# Altium project RadioTransceiverBoard.PrjPcb (part 3 of 3)

## Sheet A_conn_1P25A.SchDoc
size A; SheetNumber: 8; SheetTotal: 17
Used 11 times, as channels LMS Powering/A_conn_1P25A1, LMS Powering/A_conn_1P25A2, LMS Powering/A_conn_1P25A3, LMS Powering/A_conn_1P25A4, LMS Powering/A_conn_1P25A5, LMS Powering/A_conn_1P25A6, LMS Powering/A_conn_1P25A7, LMS Powering/A_conn_1P25A8, LMS Powering/A_conn_1P25A9, LMS Powering/A_conn_1P25A10, LMS Powering/A_conn_1P25A11. Parts and nets are listed once, with the designators drawn on the sheet.
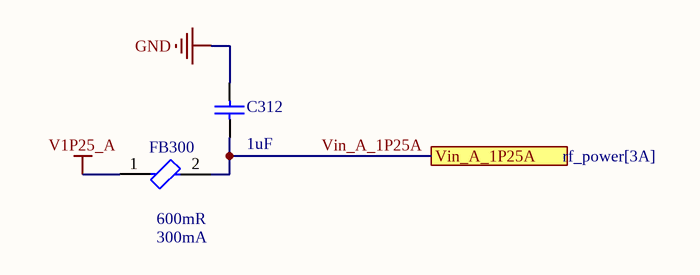
[diagram p8: A_conn_1P25A.SchDoc]

### Parts
C312  value 1uF  [CAPC2013X145X50LL20T25]  (hidden comment: C0805C105K4PACTU)
FB300  DC Resistance-Max: 600mR  Max DC Current: 300mA  [FP-BLM15-0_05-MFG]  (hidden comment: BLM15AG601SN1D)

### Ports
Vin_A_1P25A (see rf_power[3A])

### Nets
GND: C312.2
V1P25_A: FB300.1
Vin_A_1P25A: C312.1 FB300.2 ; port Vin_A_1P25A

### Channels
LMS Powering/A_conn_1P25A1: designators end in _1; ports Vin_A_1P25A=Vin_A_1P25A
LMS Powering/A_conn_1P25A2: designators end in _2; ports Vin_A_1P25A=Vin_A_1P25A
LMS Powering/A_conn_1P25A3: designators end in _3; ports Vin_A_1P25A=Vin_A_1P25A
LMS Powering/A_conn_1P25A4: designators end in _4; ports Vin_A_1P25A=Vin_A_1P25A
LMS Powering/A_conn_1P25A5: designators end in _5; ports Vin_A_1P25A=Vin_A_1P25A
LMS Powering/A_conn_1P25A6: designators end in _6; ports Vin_A_1P25A=Vin_A_1P25A
LMS Powering/A_conn_1P25A7: designators end in _7; ports Vin_A_1P25A=Vin_A_1P25A
LMS Powering/A_conn_1P25A8: designators end in _8; ports Vin_A_1P25A=Vin_A_1P25A
LMS Powering/A_conn_1P25A9: designators end in _9; ports Vin_A_1P25A=Vin_A_1P25A
LMS Powering/A_conn_1P25A10: designators end in _10; ports Vin_A_1P25A=Vin_A_1P25A
LMS Powering/A_conn_1P25A11: designators end in _11; ports Vin_A_1P25A=Vin_A_1P25A

### Library data of the parts
C312 = CMP-1036-04746-2: Manufacturer: Kemet; Part Number: C0805C105K4PACTU
FB300 = CMP-0686-00187-4: Chip Ferrite Bead, 0402, 600Ω @ 100MHz, 0.52Ω, 25%, 300mA; Number of Lines: 1; DC Resistance (DCR): 520mR; Shielding: Unshielded; Impedance: 600R; Material: Steel; Frequency: 100MHz; Lead Free: Lead Free; Test Frequency: 100MHz; Depth: 0.55mm; Length: 1mm; Case Code (Imperial): 0402; Packaging: Tape and Reel; Height: 0.5mm; Max Operating Temperature: 125°C; Military Standard: Not; REACH SVHC: No SVHC; Case Code (Metric): 1005; Series: BLM15AG_SN; Core Material: Ferrite; Termination: SMD/SMT; DC Current: 300mA; Package Quantity: 10000; Width: 0.5mm; RoHS Compliant: Yes; Min Operating Temperature: -55°C; Current Rating: 300mA; Case/Package: 0402; Number of Pins: 2; Radiation Hardening: No; Tolerance: 25%; Number of Circuits: 1; Max Current Rating: 300mA

## Sheet A_conn_1P4A.SchDoc
size A; SheetNumber: 5; SheetTotal: 17
Used 6 times, as channels LMS Powering/A_conn_1P4A1, LMS Powering/A_conn_1P4A2, LMS Powering/A_conn_1P4A3, LMS Powering/A_conn_1P4A4, LMS Powering/A_conn_1P4A5, LMS Powering/A_conn_1P4A6. Parts and nets are listed once, with the designators drawn on the sheet.
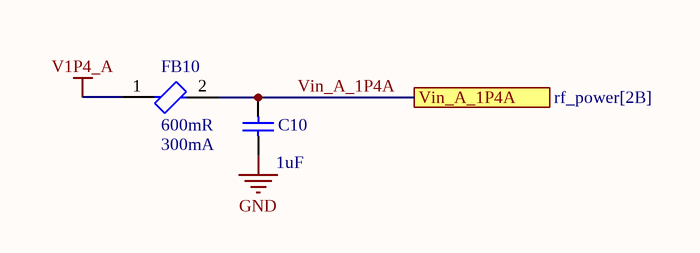
[diagram p9: A_conn_1P4A.SchDoc]

### Parts
C10  value 1uF  [CAPC2013X145X50LL20T25]  (hidden comment: C0805C105K4PACTU)
FB10  DC Resistance-Max: 600mR  Max DC Current: 300mA  [FP-BLM15-0_05-MFG]  (hidden comment: BLM15AG601SN1D)

### Ports
Vin_A_1P4A (see rf_power[2B])

### Nets
GND: C10.1
V1P4_A: FB10.1
Vin_A_1P4A: C10.2 FB10.2 ; port Vin_A_1P4A

### Channels
LMS Powering/A_conn_1P4A1: designators end in _1; ports Vin_A_1P4A=Vin_A_1P4A
LMS Powering/A_conn_1P4A2: designators end in _2; ports Vin_A_1P4A=Vin_A_1P4A
LMS Powering/A_conn_1P4A3: designators end in _3; ports Vin_A_1P4A=Vin_A_1P4A
LMS Powering/A_conn_1P4A4: designators end in _4; ports Vin_A_1P4A=Vin_A_1P4A
LMS Powering/A_conn_1P4A5: designators end in _5; ports Vin_A_1P4A=Vin_A_1P4A
LMS Powering/A_conn_1P4A6: designators end in _6; ports Vin_A_1P4A=Vin_A_1P4A

### Library data of the parts
C10 = CMP-1036-04746-2: Manufacturer: Kemet; Part Number: C0805C105K4PACTU
FB10 = CMP-0686-00187-4: as FB300 on sheet A_conn_1P25A; Frequency: 100MHz; Lead Free: Lead Free; Test Frequency: 100MHz; Depth: 0.55mm; Length: 1mm; Case Code (Imperial): 0402; Packaging: Tape and Reel; Height: 0.5mm; Max Operating Temperature: 125°C; Military Standard: Not; REACH SVHC: No SVHC; Case Code (Metric): 1005; Series: BLM15AG_SN; Core Material: Ferrite; Termination: SMD/SMT; DC Current: 300mA; Package Quantity: 10000; Width: 0.5mm; RoHS Compliant: Yes; Min Operating Temperature: -55°C; Current Rating: 300mA; Case/Package: 0402; Number of Pins: 2; Radiation Hardening: No; Tolerance: 25%; Number of Circuits: 1; Max Current Rating: 300mA

## Sheet B_conn_1P25A.SchDoc
size A; SheetNumber: 3; SheetTotal: 17
Used 3 times, as channels LMS Powering/B_conn_1P25A1, LMS Powering/B_conn_1P25A2, LMS Powering/B_conn_1P25A3. Parts and nets are listed once, with the designators drawn on the sheet.
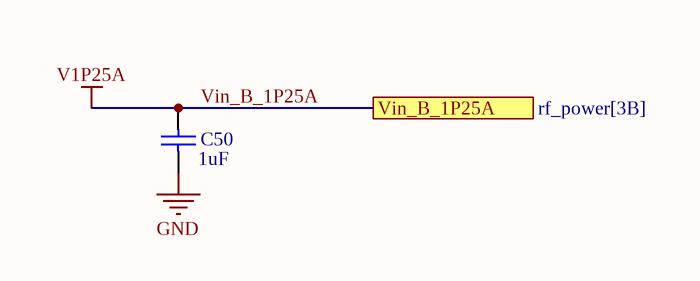
[diagram p10: B_conn_1P25A.SchDoc]

### Parts
C50  value 1uF  [CAPC2013X145X50LL20T25]  (hidden comment: C0805C105K4PACTU)

### Ports
Vin_B_1P25A (see rf_power[3B])

### Nets
GND: C50.1
Vin_B_1P25A: C50.2 ; port Vin_B_1P25A  [also labelled V1P25A]

### Channels
LMS Powering/B_conn_1P25A1: designators end in _1; ports Vin_B_1P25A=Vin_B_1P25A
LMS Powering/B_conn_1P25A2: designators end in _2; ports Vin_B_1P25A=Vin_B_1P25A
LMS Powering/B_conn_1P25A3: designators end in _3; ports Vin_B_1P25A=Vin_B_1P25A

### Library data of the parts
C50 = CMP-1036-04746-2: Manufacturer: Kemet; Part Number: C0805C105K4PACTU

## Sheet A_conn_1P25D.SchDoc
size A; SheetNumber: 9; SheetTotal: 17
Used 4 times, as channels LMS Powering/A_conn_1P25D1, LMS Powering/A_conn_1P25D2, LMS Powering/A_conn_1P25D3, LMS Powering/A_conn_1P25D4. Parts and nets are listed once, with the designators drawn on the sheet.
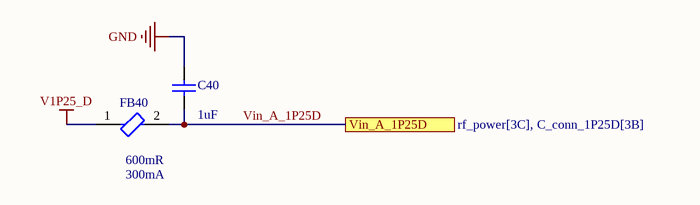
[diagram p11: A_conn_1P25D.SchDoc]

### Parts
C40  value 1uF  [CAPC2013X145X50LL20T25]  (hidden comment: C0805C105K4PACTU)
FB40  DC Resistance-Max: 600mR  Max DC Current: 300mA  [FP-BLM15-0_05-MFG]  (hidden comment: BLM15AG601SN1D)

### Ports
Vin_A_1P25D (see rf_power[3C], C_conn_1P25D[3B])

### Nets
GND: C40.2
V1P25_D: FB40.1
Vin_A_1P25D: C40.1 FB40.2 ; port Vin_A_1P25D

### Channels
LMS Powering/A_conn_1P25D1: designators end in _1; ports Vin_A_1P25D=Vin_A_1P25D
LMS Powering/A_conn_1P25D2: designators end in _2; ports Vin_A_1P25D=Vin_A_1P25D
LMS Powering/A_conn_1P25D3: designators end in _3; ports Vin_A_1P25D=Vin_A_1P25D
LMS Powering/A_conn_1P25D4: designators end in _4; ports Vin_A_1P25D=Vin_A_1P25D

### Library data of the parts
C40 = CMP-1036-04746-2: Manufacturer: Kemet; Part Number: C0805C105K4PACTU
FB40 = CMP-0686-00187-4: as FB300 on sheet A_conn_1P25A; Frequency: 100MHz; Lead Free: Lead Free; Test Frequency: 100MHz; Depth: 0.55mm; Length: 1mm; Case Code (Imperial): 0402; Packaging: Tape and Reel; Height: 0.5mm; Max Operating Temperature: 125°C; Military Standard: Not; REACH SVHC: No SVHC; Case Code (Metric): 1005; Series: BLM15AG_SN; Core Material: Ferrite; Termination: SMD/SMT; DC Current: 300mA; Package Quantity: 10000; Width: 0.5mm; RoHS Compliant: Yes; Min Operating Temperature: -55°C; Current Rating: 300mA; Case/Package: 0402; Number of Pins: 2; Radiation Hardening: No; Tolerance: 25%; Number of Circuits: 1; Max Current Rating: 300mA

## Sheet D_conn_1P25A.SchDoc
size A; SheetNumber: 6; SheetTotal: 17
Used 2 times, as channels LMS Powering/D_conn_1P25A1, LMS Powering/D_conn_1P25A2. Parts and nets are listed once, with the designators drawn on the sheet.
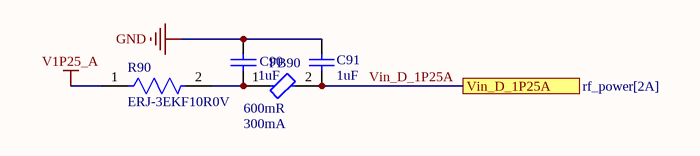
[diagram p12: D_conn_1P25A.SchDoc]

### Parts
C90  value 1uF  [CAPC2013X145X50LL20T25]  (hidden comment: C0805C105K4PACTU)
C91  value 1uF  [CAPC2013X145X50LL20T25]  (hidden comment: C0805C105K4PACTU)
FB90  DC Resistance-Max: 600mR  Max DC Current: 300mA  [FP-BLM15-0_05-MFG]  (hidden comment: BLM15AG601SN1D)
R90  ERJ-3EKF10R0V  [FP-ERJ3EK-MFG]

### Ports
Vin_D_1P25A (see rf_power[2A])

### Nets
GND: C90.2 C91.2
V1P25_A: R90.1
Vin_D_1P25A: C91.1 FB90.2 ; port Vin_D_1P25A
NetC90_1: C90.1 FB90.1 R90.2

### Channels
LMS Powering/D_conn_1P25A1: designators end in _1; ports Vin_D_1P25A=Vin_D_1P25A
LMS Powering/D_conn_1P25A2: designators end in _2; ports Vin_D_1P25A=Vin_D_1P25A

### Library data of the parts
C90 C91 = CMP-1036-04746-2: Manufacturer: Kemet; Part Number: C0805C105K4PACTU
FB90 = CMP-0686-00187-4: as FB300 on sheet A_conn_1P25A; Frequency: 100MHz; Lead Free: Lead Free; Test Frequency: 100MHz; Depth: 0.55mm; Length: 1mm; Case Code (Imperial): 0402; Packaging: Tape and Reel; Height: 0.5mm; Max Operating Temperature: 125°C; Military Standard: Not; REACH SVHC: No SVHC; Case Code (Metric): 1005; Series: BLM15AG_SN; Core Material: Ferrite; Termination: SMD/SMT; DC Current: 300mA; Package Quantity: 10000; Width: 0.5mm; RoHS Compliant: Yes; Min Operating Temperature: -55°C; Current Rating: 300mA; Case/Package: 0402; Number of Pins: 2; Radiation Hardening: No; Tolerance: 25%; Number of Circuits: 1; Max Current Rating: 300mA
R90 = CMP-2000-00195-2: RES SMD 10 OHM 1% 1/10W 0603; Manufacturer: Panasonic; Resistance: 10Ω; Voltage Rating: 75V; Value: 10Ω; Power: 100mW; Power Rating: 0.1W; Temperature Coefficient: 100ppm/°C; Automotive Grade: Grade 0; Lead Free: Yes; Device Class L1: Passive Components; Digikey Description: RES SMD 10 OHM 1% 1/10W 0603; Octopart: https://octopart.com/erj-3ekf10r0v-panasonic-55403649; Automotive: Yes; ComponentLink2URL: https://b2b-api.panasonic.eu/file_stream/pids/fileversion/1263; Manufacturer Part Number: ERJ-3EKF10R0V; Height: 0.55mm; Temperature Range High: +155°C; Footprint Url: https://industrial.panasonic.com/cdbs/www-data/pdf/RDA0000/DMA0000COL17.pdf; Temperature: -55°C to +155°C; Tolerance: 1%; ComponentLink2Description: Datasheet; Package: ERJ3EK; Device Class L2: Resistors; Category: Res; Ipc Land Pattern Name: RESC16080X45; RoHS: TRUE; Composition: Thick Film; Device Class L3: Chip SMD Resistors; Temperature Range Low: -55°C; Series: ERJ

## Sheet A_conn_1P8A.SchDoc
size A; SheetNumber: 7; SheetTotal: 17
Used 10 times, as channels LMS Powering/A_conn_1P8A1, LMS Powering/A_conn_1P8A2, LMS Powering/A_conn_1P8A3, LMS Powering/A_conn_1P8A4, LMS Powering/A_conn_1P8A5, LMS Powering/A_conn_1P8A6, LMS Powering/A_conn_1P8A7, LMS Powering/A_conn_1P8A8, LMS Powering/A_conn_1P8A9, LMS Powering/A_conn_1P8A10. Parts and nets are listed once, with the designators drawn on the sheet.
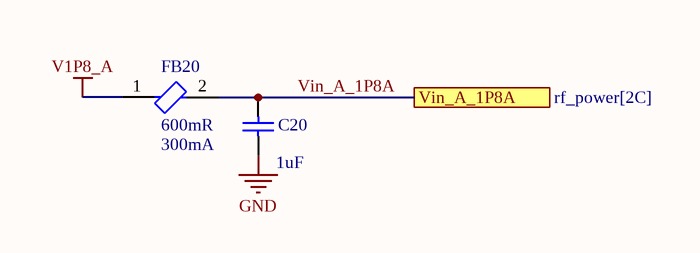
[diagram p13: A_conn_1P8A.SchDoc]

### Parts
C20  value 1uF  [CAPC2013X145X50LL20T25]  (hidden comment: C0805C105K4PACTU)
FB20  DC Resistance-Max: 600mR  Max DC Current: 300mA  [FP-BLM15-0_05-MFG]  (hidden comment: BLM15AG601SN1D)

### Ports
Vin_A_1P8A (see rf_power[2C])

### Nets
GND: C20.1
V1P8_A: FB20.1
Vin_A_1P8A: C20.2 FB20.2 ; port Vin_A_1P8A

### Channels
LMS Powering/A_conn_1P8A1: designators end in _1; ports Vin_A_1P8A=Vin_A_1P8A
LMS Powering/A_conn_1P8A2: designators end in _2; ports Vin_A_1P8A=Vin_A_1P8A
LMS Powering/A_conn_1P8A3: designators end in _3; ports Vin_A_1P8A=Vin_A_1P8A
LMS Powering/A_conn_1P8A4: designators end in _4; ports Vin_A_1P8A=Vin_A_1P8A
LMS Powering/A_conn_1P8A5: designators end in _5; ports Vin_A_1P8A=Vin_A_1P8A
LMS Powering/A_conn_1P8A6: designators end in _6; ports Vin_A_1P8A=Vin_A_1P8A
LMS Powering/A_conn_1P8A7: designators end in _7; ports Vin_A_1P8A=Vin_A_1P8A
LMS Powering/A_conn_1P8A8: designators end in _8; ports Vin_A_1P8A=Vin_A_1P8A
LMS Powering/A_conn_1P8A9: designators end in _9; ports Vin_A_1P8A=Vin_A_1P8A
LMS Powering/A_conn_1P8A10: designators end in _10; ports Vin_A_1P8A=Vin_A_1P8A

### Library data of the parts
C20 = CMP-1036-04746-2: Manufacturer: Kemet; Part Number: C0805C105K4PACTU
FB20 = CMP-0686-00187-4: as FB300 on sheet A_conn_1P25A; Frequency: 100MHz; Lead Free: Lead Free; Test Frequency: 100MHz; Depth: 0.55mm; Length: 1mm; Case Code (Imperial): 0402; Packaging: Tape and Reel; Height: 0.5mm; Max Operating Temperature: 125°C; Military Standard: Not; REACH SVHC: No SVHC; Case Code (Metric): 1005; Series: BLM15AG_SN; Core Material: Ferrite; Termination: SMD/SMT; DC Current: 300mA; Package Quantity: 10000; Width: 0.5mm; RoHS Compliant: Yes; Min Operating Temperature: -55°C; Current Rating: 300mA; Case/Package: 0402; Number of Pins: 2; Radiation Hardening: No; Tolerance: 25%; Number of Circuits: 1; Max Current Rating: 300mA

## Sheet D_conn_1P8A.SchDoc
size A; SheetNumber: 10; SheetTotal: 17
Used 2 times, as channels LMS Powering/D_conn_1P8A1, LMS Powering/D_conn_1P8A2. Parts and nets are listed once, with the designators drawn on the sheet.
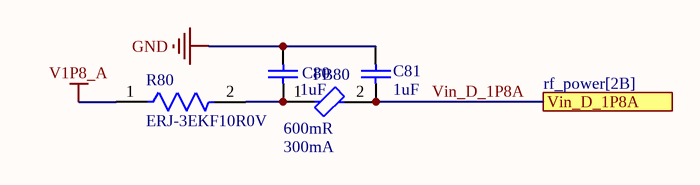
[diagram p14: D_conn_1P8A.SchDoc]

### Parts
C80  value 1uF  [CAPC2013X145X50LL20T25]  (hidden comment: C0805C105K4PACTU)
C81  value 1uF  [CAPC2013X145X50LL20T25]  (hidden comment: C0805C105K4PACTU)
FB80  DC Resistance-Max: 600mR  Max DC Current: 300mA  [FP-BLM15-0_05-MFG]  (hidden comment: BLM15AG601SN1D)
R80  ERJ-3EKF10R0V  [FP-ERJ3EK-MFG]

### Ports
Vin_D_1P8A (see rf_power[2B])

### Nets
GND: C80.2 C81.2
V1P8_A: R80.1
Vin_D_1P8A: C81.1 FB80.2 ; port Vin_D_1P8A
NetC80_1: C80.1 FB80.1 R80.2

### Channels
LMS Powering/D_conn_1P8A1: designators end in _1; ports Vin_D_1P8A=Vin_D_1P8A
LMS Powering/D_conn_1P8A2: designators end in _2; ports Vin_D_1P8A=Vin_D_1P8A

### Library data of the parts
C80 C81 = CMP-1036-04746-2: Manufacturer: Kemet; Part Number: C0805C105K4PACTU
FB80 = CMP-0686-00187-4: as FB300 on sheet A_conn_1P25A; Frequency: 100MHz; Lead Free: Lead Free; Test Frequency: 100MHz; Depth: 0.55mm; Length: 1mm; Case Code (Imperial): 0402; Packaging: Tape and Reel; Height: 0.5mm; Max Operating Temperature: 125°C; Military Standard: Not; REACH SVHC: No SVHC; Case Code (Metric): 1005; Series: BLM15AG_SN; Core Material: Ferrite; Termination: SMD/SMT; DC Current: 300mA; Package Quantity: 10000; Width: 0.5mm; RoHS Compliant: Yes; Min Operating Temperature: -55°C; Current Rating: 300mA; Case/Package: 0402; Number of Pins: 2; Radiation Hardening: No; Tolerance: 25%; Number of Circuits: 1; Max Current Rating: 300mA
R80 = CMP-2000-00195-2: as R90 on sheet D_conn_1P25A; Lead Free: Yes; Device Class L1: Passive Components; Digikey Description: RES SMD 10 OHM 1% 1/10W 0603; Octopart: https://octopart.com/erj-3ekf10r0v-panasonic-55403649; Automotive: Yes; ComponentLink2URL: https://b2b-api.panasonic.eu/file_stream/pids/fileversion/1263; Manufacturer Part Number: ERJ-3EKF10R0V; Height: 0.55mm; Temperature Range High: +155°C; Footprint Url: https://industrial.panasonic.com/cdbs/www-data/pdf/RDA0000/DMA0000COL17.pdf; Temperature: -55°C to +155°C; Tolerance: 1%; ComponentLink2Description: Datasheet; Package: ERJ3EK; Device Class L2: Resistors; Category: Res; Ipc Land Pattern Name: RESC16080X45; RoHS: TRUE; Composition: Thick Film; Device Class L3: Chip SMD Resistors; Temperature Range Low: -55°C; Series: ERJ

## Sheet C_conn_1P25D.SchDoc
size A; SheetNumber: 11; SheetTotal: 17
Used 4 times, as channels LMS Powering/C_conn_1P25D1, LMS Powering/C_conn_1P25D2, LMS Powering/C_conn_1P25D3, LMS Powering/C_conn_1P25D4. Parts and nets are listed once, with the designators drawn on the sheet.
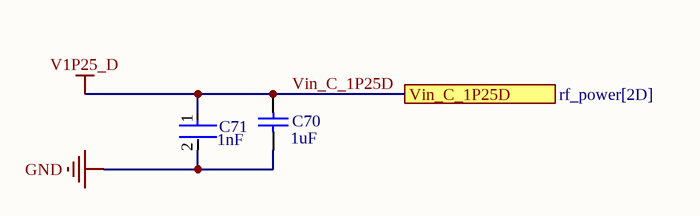
[diagram p15: C_conn_1P25D.SchDoc]

### Parts
C70  value 1uF  [CAPC2013X145X50LL20T25]  (hidden comment: C0805C105K4PACTU)
C71  Capacitance: 1nF  [FP-0805-L_2_01_0_2-W_1_25-IPC_C]  (hidden comment: 08055C102KAT2A)

### Ports
Vin_C_1P25D (see rf_power[2D])

### Nets
GND: C70.1 C71.2
Vin_C_1P25D: C70.2 C71.1 ; port Vin_C_1P25D  [also labelled V1P25_D]

### Channels
LMS Powering/C_conn_1P25D1: designators end in _1; ports Vin_C_1P25D=Vin_C_1P25D
LMS Powering/C_conn_1P25D2: designators end in _2; ports Vin_C_1P25D=Vin_C_1P25D
LMS Powering/C_conn_1P25D3: designators end in _3; ports Vin_C_1P25D=Vin_C_1P25D
LMS Powering/C_conn_1P25D4: designators end in _4; ports Vin_C_1P25D=Vin_C_1P25D

### Library data of the parts
C70 = CMP-1036-04746-2: Manufacturer: Kemet; Part Number: C0805C105K4PACTU
C71 = CMP-1036-02979-3: General Purpose Ceramic Capacitor, 0805, 1nF, 10%, X7R, 0.15, 50V; Dissipation Factor: 2.5%; Insulation Resistance: 100GR; Radiation Hardening: No; Case Code (Imperial): 0805; Packaging: Tape and Reel; Height: 0.94mm; Number of Pins: 2; REACH SVHC: No SVHC; Case Code (Metric): 2012; Voltage: 50V; Max Operating Temperature: 125°C; Tolerance: 10%; Voltage Rating: 50V; Depth: 1.25mm; Voltage Rating (DC): 50V; Thickness: 0.037inch; Termination: SMD/SMT; Package Quantity: 1; RoHS Compliant: Yes; Mount: Surface Mount; Dielectric: X7R; Length: 2.01mm; Contact Plating: Tin; Lead Free: Lead Free; Case/Package: 0805; Width: 1.25mm; Dielectric Material: Ceramic; Min Operating Temperature: -55°C

## Sheet C_conn_1P8D.SchDoc
size A; SheetNumber: 4; SheetTotal: 17
Used 4 times, as channels LMS Powering/C_conn_1P8D1, LMS Powering/C_conn_1P8D2, LMS Powering/C_conn_1P8D3, LMS Powering/C_conn_1P8D4. Parts and nets are listed once, with the designators drawn on the sheet.
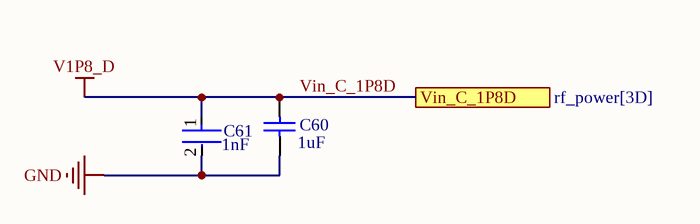
[diagram p16: C_conn_1P8D.SchDoc]

### Parts
C60  value 1uF  [CAPC2013X145X50LL20T25]  (hidden comment: C0805C105K4PACTU)
C61  Capacitance: 1nF  [FP-0805-L_2_01_0_2-W_1_25-IPC_C]  (hidden comment: 08055C102KAT2A)

### Ports
Vin_C_1P8D (see rf_power[3D])

### Nets
GND: C60.1 C61.2
Vin_C_1P8D: C60.2 C61.1 ; port Vin_C_1P8D  [also labelled V1P8_D]

### Channels
LMS Powering/C_conn_1P8D1: designators end in _1; ports Vin_C_1P8D=Vin_C_1P8D
LMS Powering/C_conn_1P8D2: designators end in _2; ports Vin_C_1P8D=Vin_C_1P8D
LMS Powering/C_conn_1P8D3: designators end in _3; ports Vin_C_1P8D=Vin_C_1P8D
LMS Powering/C_conn_1P8D4: designators end in _4; ports Vin_C_1P8D=Vin_C_1P8D

### Library data of the parts
C60 = CMP-1036-04746-2: Manufacturer: Kemet; Part Number: C0805C105K4PACTU
C61 = CMP-1036-02979-3: as C71 on sheet C_conn_1P25D; Radiation Hardening: No; Case Code (Imperial): 0805; Packaging: Tape and Reel; Height: 0.94mm; Number of Pins: 2; REACH SVHC: No SVHC; Case Code (Metric): 2012; Voltage: 50V; Max Operating Temperature: 125°C; Tolerance: 10%; Voltage Rating: 50V; Depth: 1.25mm; Voltage Rating (DC): 50V; Thickness: 0.037inch; Termination: SMD/SMT; Package Quantity: 1; RoHS Compliant: Yes; Mount: Surface Mount; Dielectric: X7R; Length: 2.01mm; Contact Plating: Tin; Lead Free: Lead Free; Case/Package: 0805; Width: 1.25mm; Dielectric Material: Ceramic; Min Operating Temperature: -55°C

## Nets that join several sheets
GND: fpga (11 pins), lms_interface (8 pins), LMS7002M Interface/rf_transmit1 (6 pins), LMS7002M Interface/rf_transmit2 (6 pins), LMS7002M Interface/rf_receive1 (5 pins), LMS7002M Interface/rf_receive2 (5 pins), usb_controller (40 pins), power_regulation (56 pins), rf_power (25 pins), LMS Powering/A_conn_1P25A1 (C312_1.2), LMS Powering/A_conn_1P25A2 (C312_2.2), LMS Powering/A_conn_1P25A3 (C312_3.2), LMS Powering/A_conn_1P25A4 (C312_4.2), LMS Powering/A_conn_1P25A5 (C312_5.2), LMS Powering/A_conn_1P25A6 (C312_6.2), LMS Powering/A_conn_1P25A7 (C312_7.2), LMS Powering/A_conn_1P25A8 (C312_8.2), LMS Powering/A_conn_1P25A9 (C312_9.2), LMS Powering/A_conn_1P25A10 (C312_10.2), LMS Powering/A_conn_1P25A11 (C312_11.2), LMS Powering/A_conn_1P4A1 (C10_1.1), LMS Powering/A_conn_1P4A2 (C10_2.1), LMS Powering/A_conn_1P4A3 (C10_3.1), LMS Powering/A_conn_1P4A4 (C10_4.1), LMS Powering/A_conn_1P4A5 (C10_5.1), LMS Powering/A_conn_1P4A6 (C10_6.1), LMS Powering/B_conn_1P25A1 (C50_1.1), LMS Powering/B_conn_1P25A2 (C50_2.1), LMS Powering/B_conn_1P25A3 (C50_3.1), LMS Powering/A_conn_1P25D1 (C40_1.2), LMS Powering/A_conn_1P25D2 (C40_2.2), LMS Powering/A_conn_1P25D3 (C40_3.2), LMS Powering/A_conn_1P25D4 (C40_4.2), LMS Powering/D_conn_1P25A1 (C90_1.2 C91_1.2), LMS Powering/D_conn_1P25A2 (C90_2.2 C91_2.2), LMS Powering/A_conn_1P8A1 (C20_1.1), LMS Powering/A_conn_1P8A2 (C20_2.1), LMS Powering/A_conn_1P8A3 (C20_3.1), LMS Powering/A_conn_1P8A4 (C20_4.1), LMS Powering/A_conn_1P8A5 (C20_5.1), LMS Powering/A_conn_1P8A6 (C20_6.1), LMS Powering/A_conn_1P8A7 (C20_7.1), LMS Powering/A_conn_1P8A8 (C20_8.1), LMS Powering/A_conn_1P8A9 (C20_9.1), LMS Powering/A_conn_1P8A10 (C20_10.1), LMS Powering/D_conn_1P8A1 (C80_1.2 C81_1.2), LMS Powering/D_conn_1P8A2 (C80_2.2 C81_2.2), LMS Powering/C_conn_1P25D1 (C70_1.1 C71_1.2), LMS Powering/C_conn_1P25D2 (C70_2.1 C71_2.2), LMS Powering/C_conn_1P25D3 (C70_3.1 C71_3.2), LMS Powering/C_conn_1P25D4 (C70_4.1 C71_4.2), LMS Powering/C_conn_1P8D1 (C60_1.1 C61_1.2), LMS Powering/C_conn_1P8D2 (C60_2.1 C61_2.2), LMS Powering/C_conn_1P8D3 (C60_3.1 C61_3.2), LMS Powering/C_conn_1P8D4 (C60_4.1 C61_4.2)
V1P4_A: LMS Powering/A_conn_1P4A1 (FB10_1.1), LMS Powering/A_conn_1P4A2 (FB10_2.1), LMS Powering/A_conn_1P4A3 (FB10_3.1), LMS Powering/A_conn_1P4A4 (FB10_4.1), LMS Powering/A_conn_1P4A5 (FB10_5.1), LMS Powering/A_conn_1P4A6 (FB10_6.1)
V1P8: fpga (8 pins), LMS7002M Interface/rf_transmit1 (8 pins), LMS7002M Interface/rf_transmit2 (8 pins), power_regulation (8 pins)
V1P8_A: LMS Powering/A_conn_1P8A1 (FB20_1.1), LMS Powering/A_conn_1P8A2 (FB20_2.1), LMS Powering/A_conn_1P8A3 (FB20_3.1), LMS Powering/A_conn_1P8A4 (FB20_4.1), LMS Powering/A_conn_1P8A5 (FB20_5.1), LMS Powering/A_conn_1P8A6 (FB20_6.1), LMS Powering/A_conn_1P8A7 (FB20_7.1), LMS Powering/A_conn_1P8A8 (FB20_8.1), LMS Powering/A_conn_1P8A9 (FB20_9.1), LMS Powering/A_conn_1P8A10 (FB20_10.1), LMS Powering/D_conn_1P8A1 (R80_1.1), LMS Powering/D_conn_1P8A2 (R80_2.1)
V1P25_A: LMS Powering/A_conn_1P25A1 (FB300_1.1), LMS Powering/A_conn_1P25A2 (FB300_2.1), LMS Powering/A_conn_1P25A3 (FB300_3.1), LMS Powering/A_conn_1P25A4 (FB300_4.1), LMS Powering/A_conn_1P25A5 (FB300_5.1), LMS Powering/A_conn_1P25A6 (FB300_6.1), LMS Powering/A_conn_1P25A7 (FB300_7.1), LMS Powering/A_conn_1P25A8 (FB300_8.1), LMS Powering/A_conn_1P25A9 (FB300_9.1), LMS Powering/A_conn_1P25A10 (FB300_10.1), LMS Powering/A_conn_1P25A11 (FB300_11.1), LMS Powering/D_conn_1P25A1 (R90_1.1), LMS Powering/D_conn_1P25A2 (R90_2.1)
V3P3: fpga (J200.5), usb_controller (11 pins), power_regulation (15 pins)
VBUS: usb_controller (FB103.2 U100.E10 U100.E11), power_regulation (20 pins)
Vin_B_1P25A: power_regulation (5 pins), rf_power (.AL19 .F20 .J3), LMS Powering/B_conn_1P25A1 (C50_1.2), LMS Powering/B_conn_1P25A2 (C50_2.2), LMS Powering/B_conn_1P25A3 (C50_3.2)
Vin_C_1P8D: lms_interface (6 pins), rf_power (.AH30 .H32 .T32 .W33), LMS Powering/C_conn_1P8D1 (C60_1.2 C61_1.1), LMS Powering/C_conn_1P8D2 (C60_2.2 C61_2.1), LMS Powering/C_conn_1P8D3 (C60_3.2 C61_3.1), LMS Powering/C_conn_1P8D4 (C60_4.2 C61_4.1)
Vin_C_1P25D: power_regulation (8 pins), rf_power (.AA29 .AE29 .L33 .R31), LMS Powering/A_conn_1P25D1 (FB40_1.1), LMS Powering/A_conn_1P25D2 (FB40_2.1), LMS Powering/A_conn_1P25D3 (FB40_3.1), LMS Powering/A_conn_1P25D4 (FB40_4.1), LMS Powering/C_conn_1P25D1 (C70_1.2 C71_1.1), LMS Powering/C_conn_1P25D2 (C70_2.2 C71_2.1), LMS Powering/C_conn_1P25D3 (C70_3.2 C71_3.1), LMS Powering/C_conn_1P25D4 (C70_4.2 C71_4.1)
FPGA_SPI_CLK: fpga (IC200#2.F5 U200.3), lms_interface (U400.C29)
FPGA_SPI_CS: fpga (IC201.L11 U200.10), lms_interface (U400.D28)
FPGA_SPI_MISO: fpga (IC201.H15 U200.13), lms_interface (U400.F28)
FPGA_SPI_MOSI: fpga (IC201.H14 U200.6), lms_interface (U400.F30)
FX3_I2C_SCL: usb_controller (U100.D9 U102.6), power_regulation (IC500.A4)
FX3_I2C_SDA: usb_controller (U100.D10 U102.5), power_regulation (IC500.A5)
FX3_IF_PCLK: fpga (IC201.M10), usb_controller (R135.1)
FX3_SPI_CLK: fpga (U200.2), usb_controller (U100.D4)
FX3_SPI_CS: fpga (U200.5), usb_controller (U100.C1)
FX3_SPI_MISO: fpga (U200.11), usb_controller (U100.C2)
FX3_SPI_MOSI: fpga (U200.14), usb_controller (U100.D5)
NetIC200#3_D2: fpga (IC200#3.D2), lms_interface (R402.2 U400.E27)
NetIC200#3_D3: fpga (IC200#3.D3), lms_interface (R403.2 U400.U29)
NetIC200#3_D4: fpga (IC200#3.D4), lms_interface (R404.2 U400.V34)
NetIC200#3_E1: fpga (IC200#3.E1), lms_interface (U400.Y32)
NetIC200#3_E2: fpga (IC200#3.E2), lms_interface (U400.R33)
NetIC200#3_G1: fpga (IC200#3.G1), lms_interface (U400.P34)
NetIC200#3_G4: fpga (IC200#3.G4), lms_interface (U400.R29)
NetIC200#3_J2: fpga (IC200#3.J2), lms_interface (U400.AB34)
NetIC200#3_J3: fpga (IC200#3.J3), lms_interface (U400.AA33)
NetIC201_P11: fpga (IC201.P11), usb_controller (U100.L8)
PA1ON_: lms_interface (U401.A7), LMS7002M Interface/rf_transmit1 (C755_1.1 L751_1.1)
PA1ON_: lms_interface (U401.C11), LMS7002M Interface/rf_transmit2 (C755_2.1 L751_2.1)
PA1OP_: lms_interface (U401.B12), LMS7002M Interface/rf_transmit2 (C752_2.1 L750_2.1)
PA1OP_: lms_interface (U401.B8), LMS7002M Interface/rf_transmit1 (C752_1.1 L750_1.1)
PA2ON_: lms_interface (U401.B10), LMS7002M Interface/rf_transmit1 (C761_1.1 L753_1.1)
PA2ON_: lms_interface (U401.B14), LMS7002M Interface/rf_transmit2 (C761_2.1 L753_2.1)
PA2OP_: lms_interface (U401.A13), LMS7002M Interface/rf_transmit2 (C758_2.1 L752_2.1)
PA2OP_: lms_interface (U401.A9), LMS7002M Interface/rf_transmit1 (C758_1.1 L752_1.1)
RFGN_H_RFE_1: lms_interface (U401.AJ15), LMS7002M Interface/rf_receive1 (C546_1.1 C547_1.1)
RFGN_H_RFE_2: lms_interface (U401.AM8), LMS7002M Interface/rf_receive2 (C546_2.1 C547_2.1)
RFGN_L_RFE_1: lms_interface (U401.AM12), LMS7002M Interface/rf_receive1 (C542_1.2 C543_1.1)
RFGN_L_RFE_2: lms_interface (U401.AP6), LMS7002M Interface/rf_receive2 (C542_2.2 C543_2.1)
RFGN_W_RFE_1: lms_interface (U401.AP10), LMS7002M Interface/rf_receive1 (C550_1.1 C551_1.1)
RFGN_W_RFE_2: lms_interface (U401.AM4), LMS7002M Interface/rf_receive2 (C550_2.1 C551_2.1)
RFGP_H_RFE_1: lms_interface (U401.AK14), LMS7002M Interface/rf_receive1 (C544_1.1 C546_1.2)
RFGP_H_RFE_2: lms_interface (U401.AN7), LMS7002M Interface/rf_receive2 (C544_2.1 C546_2.2)
RFGP_L_RFE_1: lms_interface (U401.AN11), LMS7002M Interface/rf_receive1 (C540_1.1 C542_1.1)
RFGP_L_RFE_2: lms_interface (U401.AN5), LMS7002M Interface/rf_receive2 (C540_2.1 C542_2.1)
RFGP_W_RFE_1: lms_interface (U401.AN9), LMS7002M Interface/rf_receive1 (C548_1.1 C550_1.2)
RFGP_W_RFE_2: lms_interface (U401.AN3), LMS7002M Interface/rf_receive2 (C548_2.1 C550_2.2)
Vin_A_1P4A: rf_power (.AD4), LMS Powering/A_conn_1P4A6 (C10_6.2 FB10_6.2)
Vin_A_1P4A: rf_power (.AF2), LMS Powering/A_conn_1P4A4 (C10_4.2 FB10_4.2)
Vin_A_1P4A: rf_power (.AF6), LMS Powering/A_conn_1P4A3 (C10_3.2 FB10_3.2)
Vin_A_1P4A: rf_power (.AN17), LMS Powering/A_conn_1P4A2 (C10_2.2 FB10_2.2)
Vin_A_1P4A: rf_power (.C21), LMS Powering/A_conn_1P4A5 (C10_5.2 FB10_5.2)
Vin_A_1P4A: rf_power (.K2 .L5), LMS Powering/A_conn_1P4A1 (C10_1.2 FB10_1.2)
Vin_A_1P8A: rf_power (.AE3), LMS Powering/A_conn_1P8A10 (C20_10.2 FB20_10.2)
Vin_A_1P8A: rf_power (.AF4), LMS Powering/A_conn_1P8A6 (C20_6.2 FB20_6.2)
Vin_A_1P8A: rf_power (.AK22), LMS Powering/A_conn_1P8A2 (C20_2.2 FB20_2.2)
Vin_A_1P8A: rf_power (.AM18), LMS Powering/A_conn_1P8A4 (C20_4.2 FB20_4.2)
Vin_A_1P8A: rf_power (.D16), LMS Powering/A_conn_1P8A9 (C20_9.2 FB20_9.2)
Vin_A_1P8A: rf_power (.D24), LMS Powering/A_conn_1P8A8 (C20_8.2 FB20_8.2)
Vin_A_1P8A: rf_power (.E17), LMS Powering/A_conn_1P8A7 (C20_7.2 FB20_7.2)
Vin_A_1P8A: rf_power (.E21), LMS Powering/A_conn_1P8A3 (C20_3.2 FB20_3.2)
Vin_A_1P8A: rf_power (.G3), LMS Powering/A_conn_1P8A1 (C20_1.2 FB20_1.2)
Vin_A_1P8A: rf_power (.N1), LMS Powering/A_conn_1P8A5 (C20_5.2 FB20_5.2)
Vin_A_1P25A: rf_power (.AD6), LMS Powering/A_conn_1P25A10 (C312_10.1 FB300_10.2)
Vin_A_1P25A: rf_power (.AG5), LMS Powering/A_conn_1P25A9 (C312_9.1 FB300_9.2)
Vin_A_1P25A: rf_power (.AJ25), LMS Powering/A_conn_1P25A1 (C312_1.1 FB300_1.2)
Vin_A_1P25A: rf_power (.AM20), LMS Powering/A_conn_1P25A3 (C312_3.1 FB300_3.2)
Vin_A_1P25A: rf_power (.AN23), LMS Powering/A_conn_1P25A8 (C312_8.1 FB300_8.2)
Vin_A_1P25A: rf_power (.B16), LMS Powering/A_conn_1P25A6 (C312_6.1 FB300_6.2)
Vin_A_1P25A: rf_power (.C25), LMS Powering/A_conn_1P25A11 (C312_11.1 FB300_11.2)
Vin_A_1P25A: rf_power (.D6 .F8), LMS Powering/A_conn_1P25A5 (C312_5.1 FB300_5.2)
Vin_A_1P25A: rf_power (.E19), LMS Powering/A_conn_1P25A2 (C312_2.1 FB300_2.2)
Vin_A_1P25A: rf_power (.J5 .K6), LMS Powering/A_conn_1P25A7 (C312_7.1 FB300_7.2)
Vin_A_1P25A: rf_power (.P4), LMS Powering/A_conn_1P25A4 (C312_4.1 FB300_4.2)
Vin_A_1P25D: rf_power (.F24), LMS Powering/A_conn_1P25D1 (C40_1.1 FB40_1.2)
Vin_A_1P25D: rf_power (.A17), LMS Powering/A_conn_1P25D4 (C40_4.1 FB40_4.2)
Vin_A_1P25D: rf_power (.AL21), LMS Powering/A_conn_1P25D3 (C40_3.1 FB40_3.2)
Vin_A_1P25D: rf_power (.M4), LMS Powering/A_conn_1P25D2 (C40_2.1 FB40_2.2)
Vin_D_1P8A: LMS Powering/D_conn_1P8A1 (C81_1.1 FB80_1.2), LMS Powering/D_conn_1P8A2 (C81_2.1 FB80_2.2)
Vin_D_1P25A: rf_power (.AP26), LMS Powering/D_conn_1P25A2 (C91_2.1 FB90_2.2)
Vin_D_1P25A: rf_power (.G5), LMS Powering/D_conn_1P25A1 (C91_1.1 FB90_1.2)